# EAGLE design untitled (EAGLE 9.6.2)
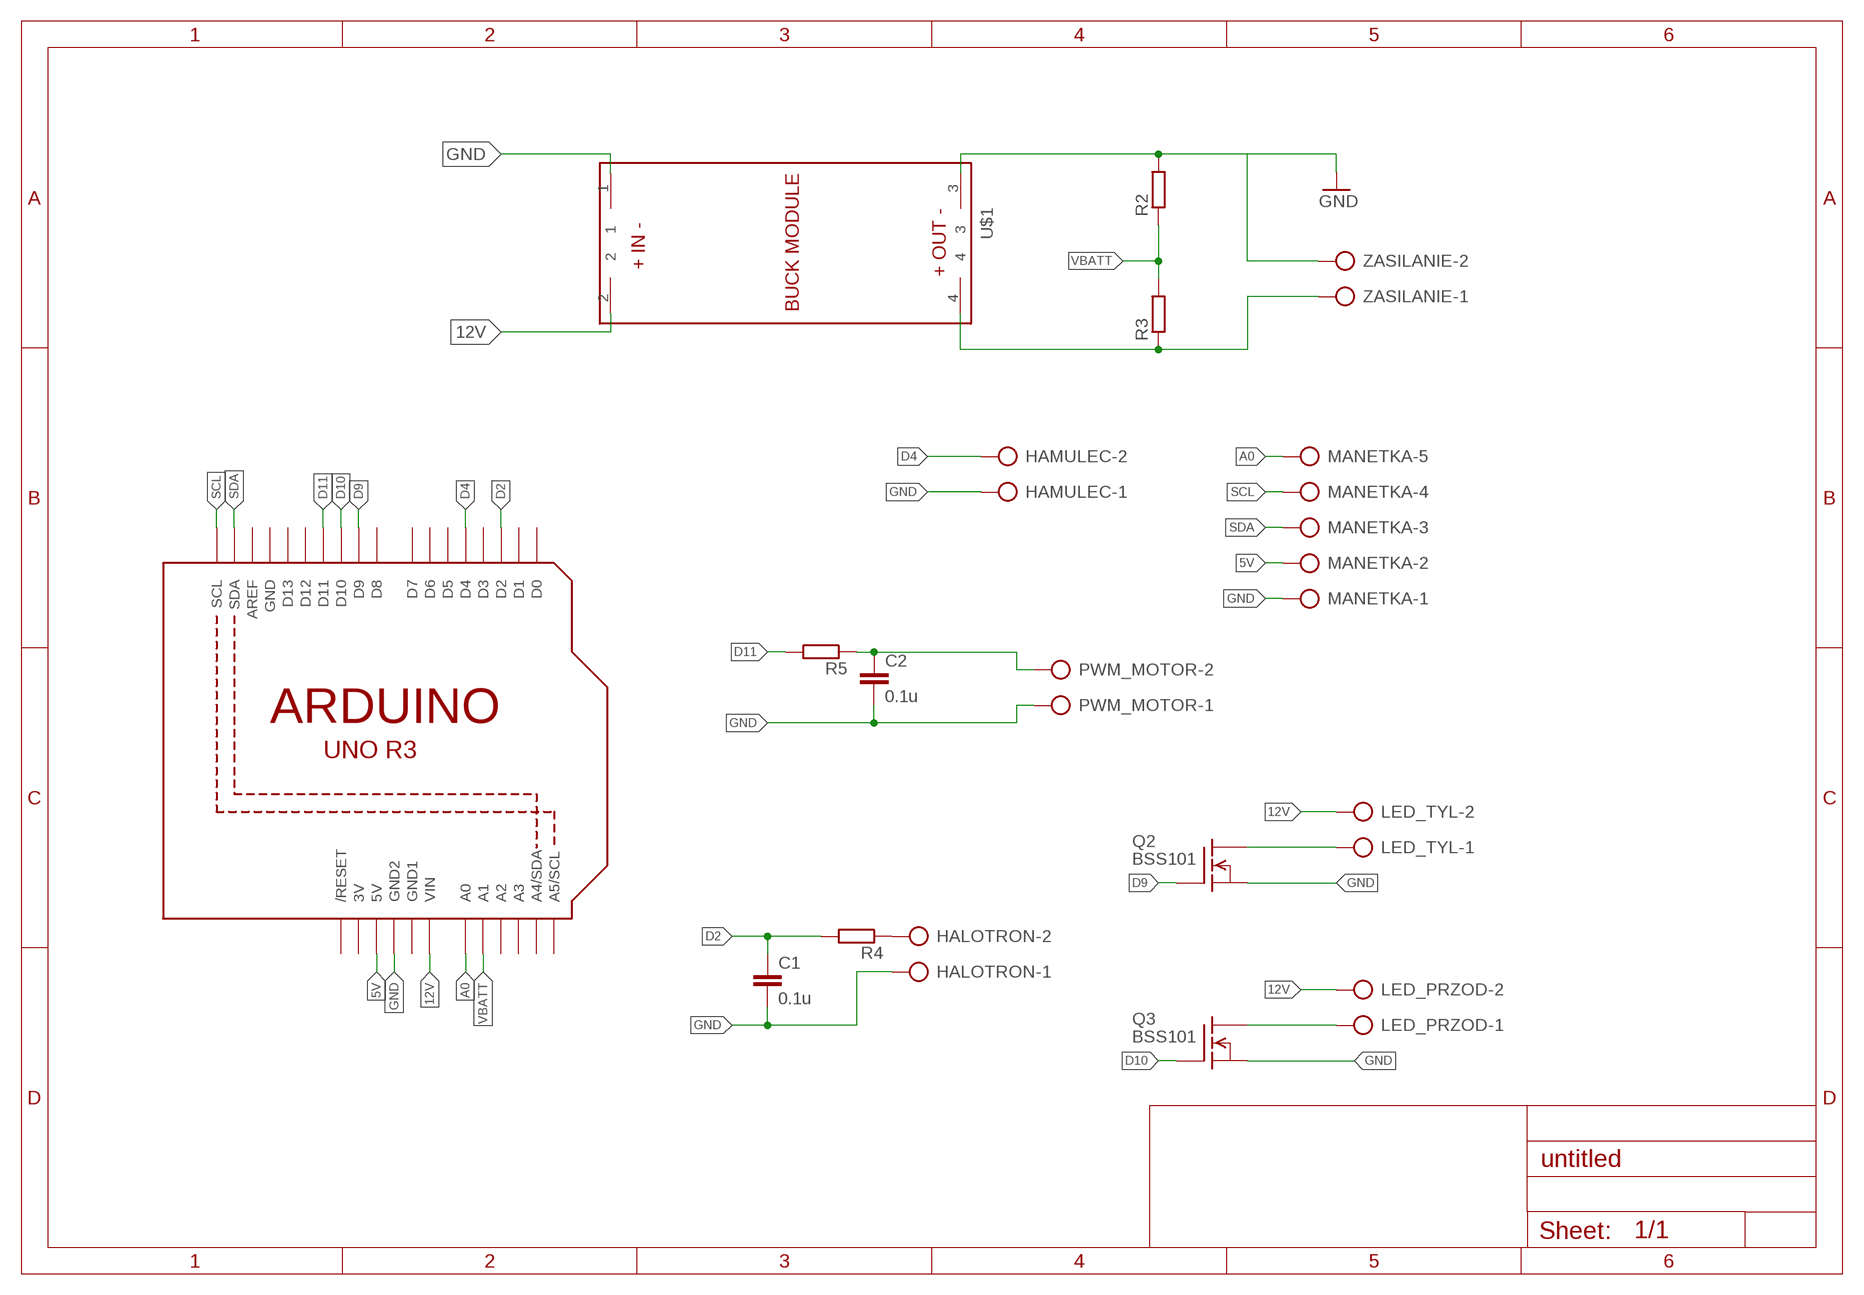
[diagram p0: schematic, sheet 1]

## Parts
C1  0.1u  C-EU025-025X050  [C025-025X050]
C2  0.1u  C-EU025-025X050  [C025-025X050]
HALOTRON  AK500/2-H  [AK500/2-H]
HAMULEC  AK500/2-H  [AK500/2-H]
LED_PRZOD  AK500/2-H  [AK500/2-H]
LED_TYL  AK500/2-H  [AK500/2-H]
MANETKA  AK300/5  [AK300/5]
PWM_MOTOR  AK500/2-H  [AK500/2-H]
Q1  ARDUINOR3-NOIOREF-NOTEXT  [ARDUINOR3-NOTEXT-NOIOREF]
Q2  BSS101  [TO92]
Q3  BSS101  [TO92]
R2  R-EU_0204/7  [0204/7]
R3  R-EU_0204/7  [0204/7]
R4  R-EU_0204/7  [0204/7]
R5  R-EU_0204/7  [0204/7]
U$1  BUCK_MODULEWITH_SMDPADS&THROUGHHOLES  [BUCK_MODULE]
ZASILANIE  AK500/2-H  [AK500/2-H]

## Nets
5V: MANETKA.2 Q1.5V
12V: LED_PRZOD.2 LED_TYL.2 Q1.VIN U$1.2
A0: MANETKA.5 Q1.A0
D2: C1.1 Q1.D2 R4.2
D4: HAMULEC.2 Q1.D4
D9: Q1.D9 Q2.2(G)
D10: Q1.D10 Q3.2(G)
D11: Q1.D11 R5.2
GND: C1.2 C2.2 HALOTRON.1 HAMULEC.1 MANETKA.1 PWM_MOTOR.1 Q1.GND2 Q2.1(S) Q3.1(S) U$1.1
N$1: R2.2 U$1.3 ZASILANIE.2 ; supply symbol labelled GND
N$2: HALOTRON.2 R4.1
N$3: R3.1 U$1.4 ZASILANIE.1
N$4: C2.1 PWM_MOTOR.2 R5.1
N$5: LED_TYL.1 Q2.3(D)
N$6: LED_PRZOD.1 Q3.3(D)
SCL: MANETKA.4 Q1.SCL
SDA: MANETKA.3 Q1.SDA
VBATT: Q1.A1 R2.1 R3.2
Unconnected: Q1.A2 Q1.A3 Q1.A4(A4/SDA) Q1.A5(A5/SCL) Q1.AREF Q1.D0 Q1.D1 Q1.D3 Q1.D5 Q1.D6 Q1.D7 Q1.D8 Q1.D12 Q1.D13 Q1.RESET(/RESET)

## Power pins joined to a net without a drawn wire
3V: Q1.3V
GND1: Q1.GND1
N$1: Q1.GND

## Library data of the parts
C1 C2 = rcl:C-EU: CAPACITOR, European symbol; SPICEPREFIX: C
HALOTRON HAMULEC LED_PRZOD LED_TYL PWM_MOTOR ZASILANIE = con-ptr500:AK500/2-H: CONNECTOR Aug. 2004 / PTR Meßtechnik: Die Bezeichnung der Serie AK505 wurde geändert. Es handelt sich hierbei um AK500 in horizontaler Ausführung.; OC_FARNELL: unknown; OC_NEWARK: unknown
MANETKA = con-ptr500:AK300/5: CONNECTOR; OC_FARNELL: unknown; OC_NEWARK: unknown
Q1 = adafruit:ARDUINOR3-NOIOREF
Q2 Q3 = transistor-fet:BSS101: N-Channel Enhancement MOSFET 200V; 0,16A; 11Ohm
R2-R5 = rcl:R-EU_: RESISTOR, European symbol; SPICEPREFIX: R
U$1 = BUCK_MODULE:BUCK_MODULE

## Board
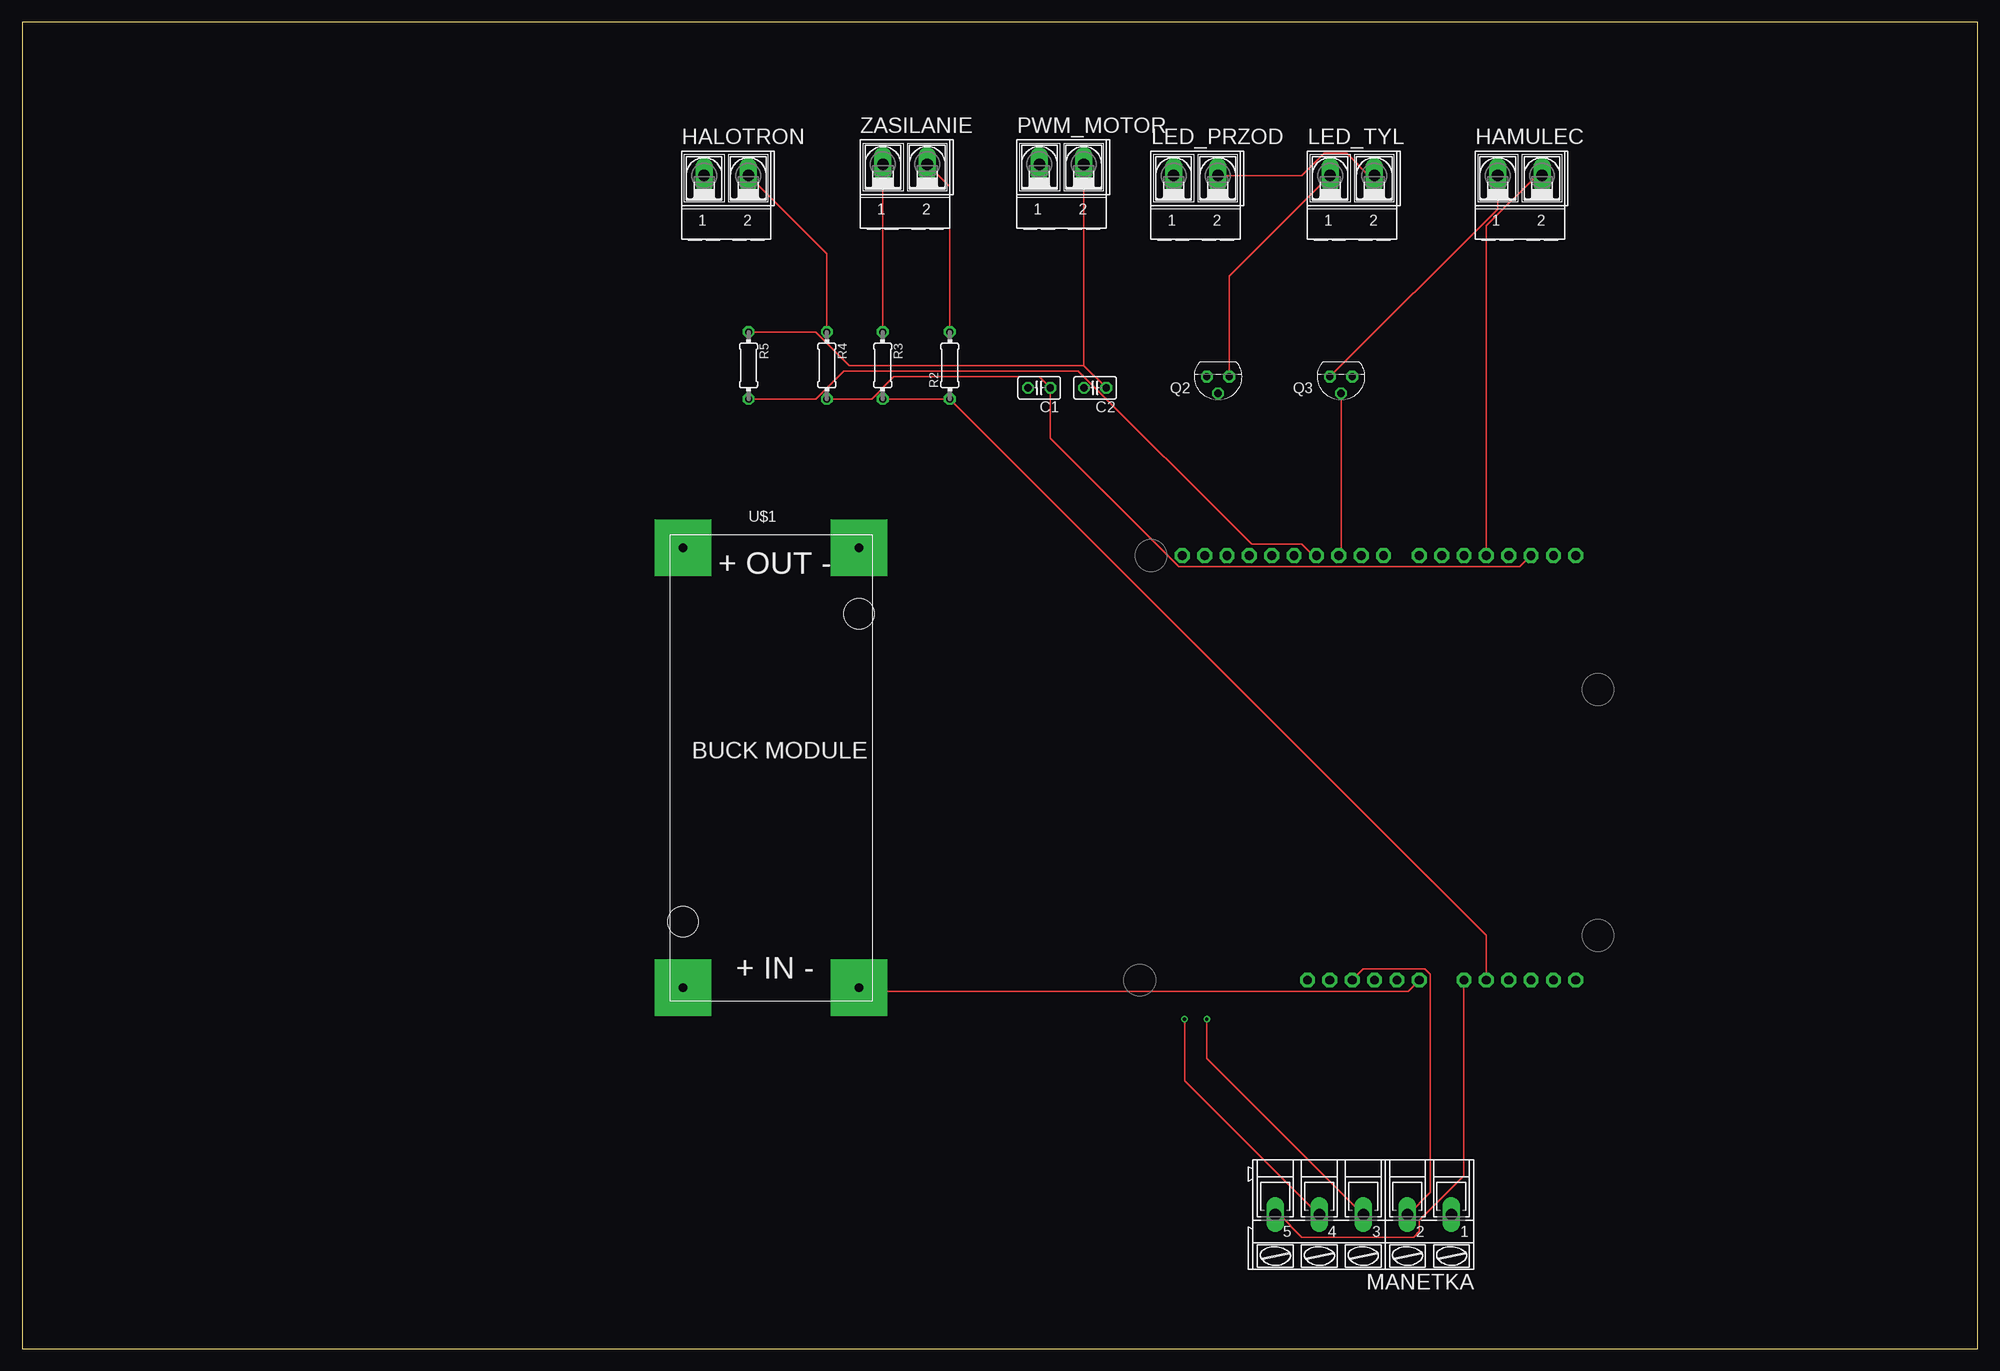
[diagram p1: board, top side]
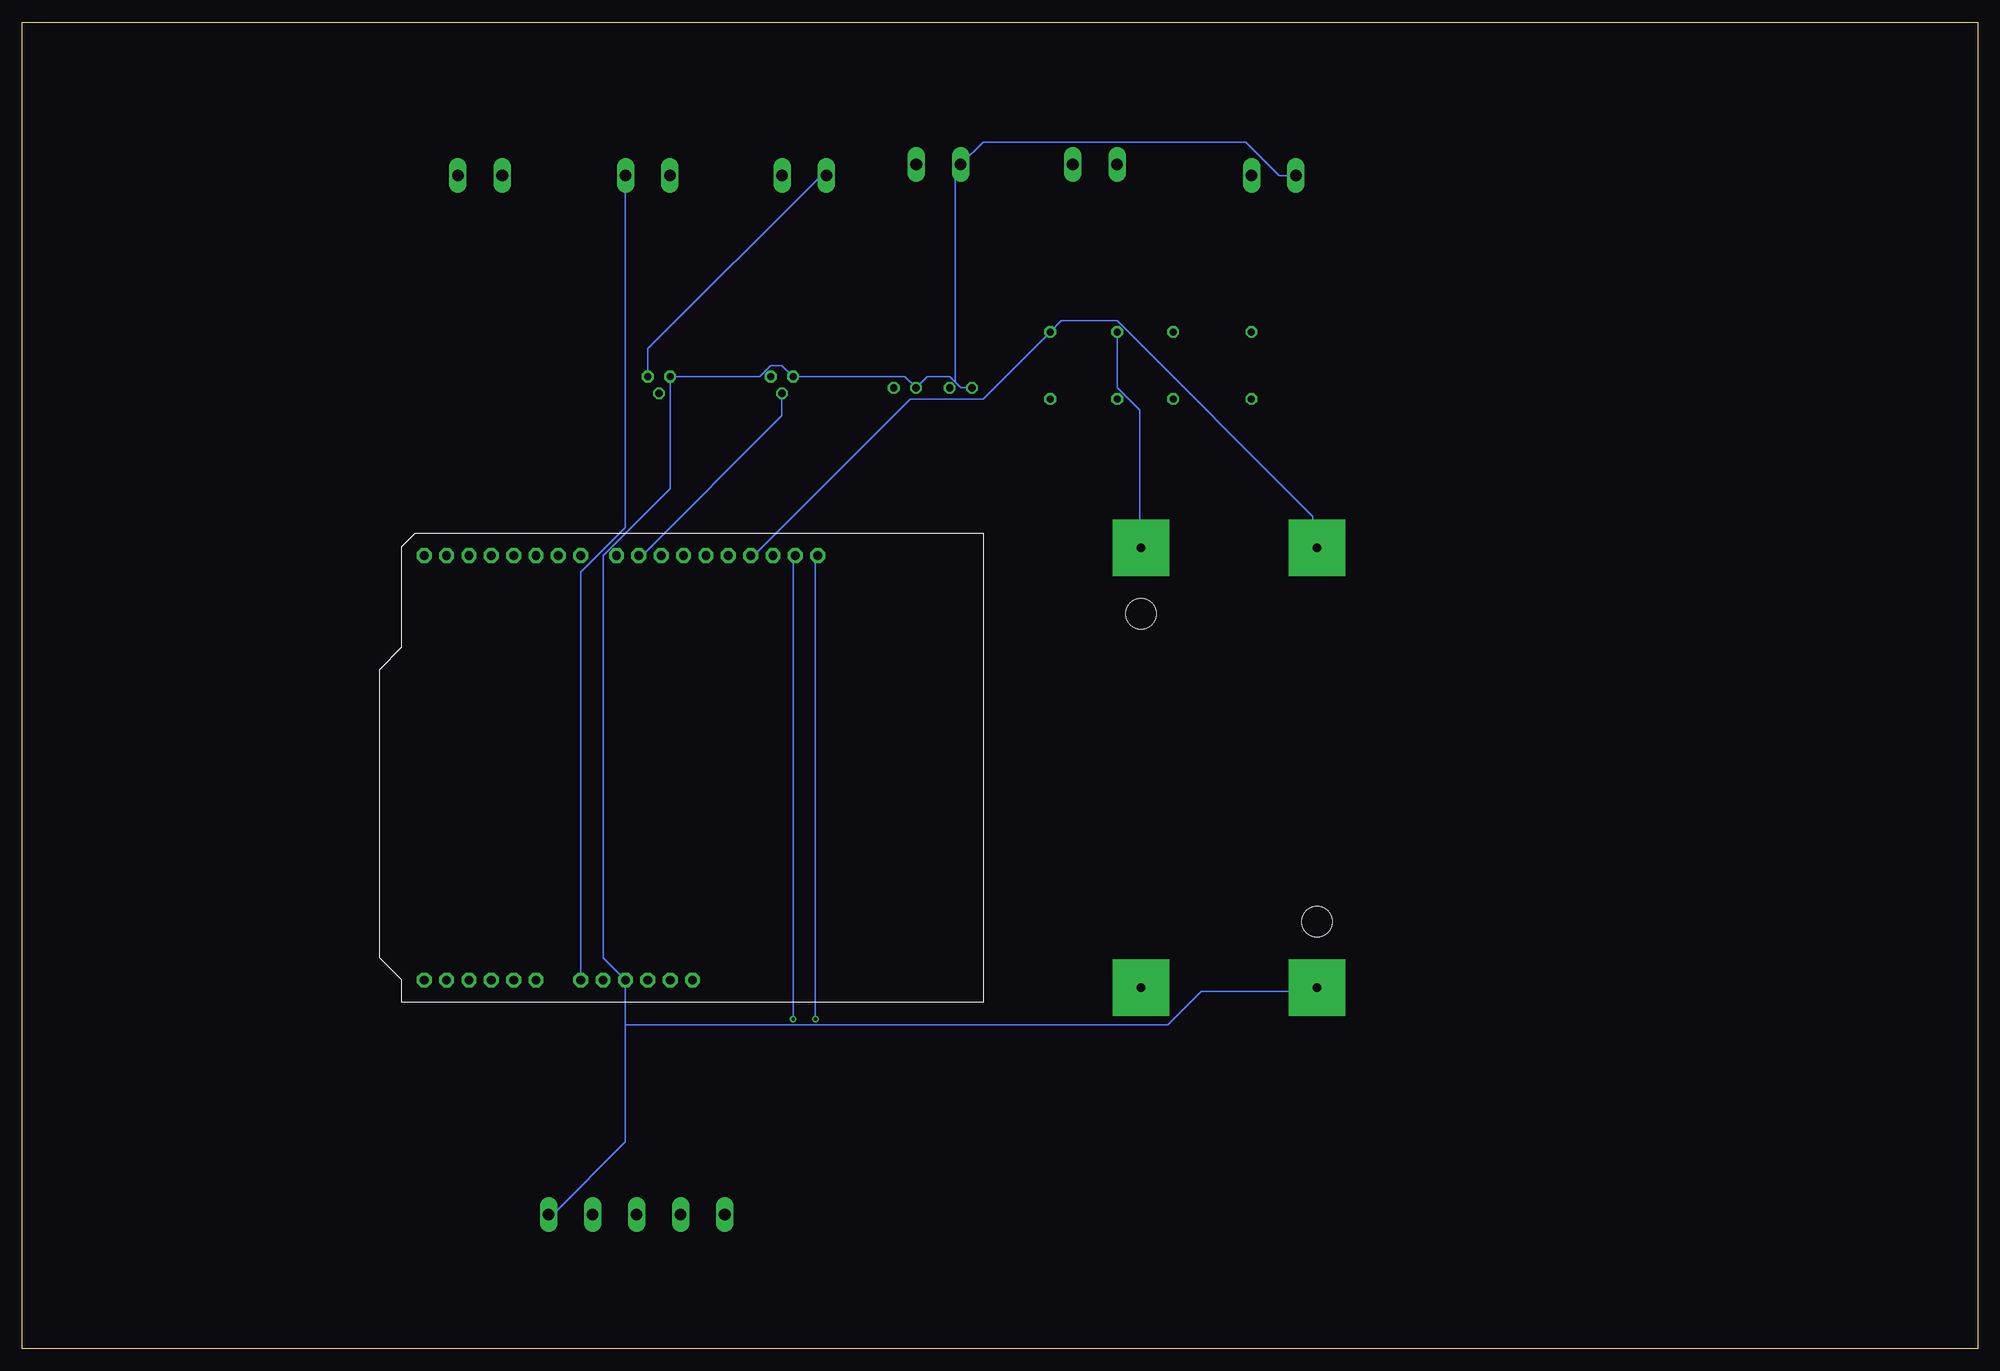
[diagram p2: board, bottom side, seen from below]

Size 222.23 x 150.8 mm. Coordinates in mm from the lower left corner, seen from the top.
Outline: 0,0 222.23,0 222.23,150.8 0,150.8 0,0
Copper layers (1*16): Top 0.035mm / dielectric 1.5mm / Bottom 0.035mm
Design rules "default": minimum track width 6mil, minimum drill 0.35mm, track to track 6mil, track to pad 6mil, pad to pad 6mil, via to via 6mil, smd to smd 6mil, copper to edge 40mil, drill to drill 6mil, minimum pad ring 10mil, minimum via ring 8mil, stop-mask expansion 4mil, vias tented up to drill 0mil, thermal gap 10mil

### Footprints (pad centres in the part's own frame; a part is rotated, then mirrored left to right if it is on the bottom)
C025-025X050 = drill 0.813 octagon: 1 -1.27,0; 2 1.27,0
AK500/2-H = drill 1.321 long: 1 -2.515,0; 2 2.515,0
AK300/5 = drill 1.321 long: 1 -10.008,0; 2 -5.004,0; 3 0,0; 4 5.004,0; 5 10.008,0
ARDUINOR3-NOTEXT-NOIOREF = drill 1 pad 1.676 octagon: 3V 35.56,2.54; 5V 38.1,2.54; A0 50.8,2.54; A1 53.34,2.54; A2 55.88,2.54; A3 58.42,2.54; A4 60.96,2.54; A5 63.5,2.54; AREF 23.876,50.8; D0 63.5,50.8; D1 60.96,50.8; D2 58.42,50.8; D3 55.88,50.8; D4 53.34,50.8; D5 50.8,50.8; D6 48.26,50.8; D7 45.72,50.8; D8 41.656,50.8; D9 39.116,50.8; D10 36.576,50.8; D11 34.036,50.8; D12 31.496,50.8; D13 28.956,50.8; GND 26.416,50.8; GND1 43.18,2.54; GND2 40.64,2.54; RESET 33.02,2.54; SCL 18.796,50.8; SDA 21.336,50.8; VIN 45.72,2.54
TO92 = drill 0.813 octagon: 1 1.27,0; 2 0,1.905; 3 -1.27,0
0204/7 = drill 0.813 octagon: 1 -3.81,0; 2 3.81,0
BUCK_MODULE = drill 1 pad 6.452 square: 1 -10,-25; 2 10,-25; 3 -10,25; 4 10,25 | hole 3.5: -10,-17.5; 10,17.5

### Placement (x,y rotation side)
C1  115.57,109.22 180 top
C2  121.92,109.22 180 top
HALOTRON  80.01,133.35 0 top
HAMULEC  170.18,133.35 0 top
LED_PRZOD  133.35,133.35 0 top
LED_TYL  151.13,133.35 0 top
MANETKA  152.4,15.24 180 top
PWM_MOTOR  118.11,134.62 0 top
Q1  113.03,39.37 0 top
Q2  135.89,110.49 180 top
Q3  149.86,110.49 180 top
R2  105.41,111.76 90 top
R3  97.79,111.76 270 top
R4  91.44,111.76 270 top
R5  82.55,111.76 270 top
U$1  85.09,66.04 0 top
ZASILANIE  100.33,134.62 0 top

### Tracks (layer width: path | path; a pad name or v marks a point on that pad's centre or on a via)
5V
  Top 0.152: Q1.5V 152.4,43.18 159.38,43.18 160.02,42.55 160.02,17.78 157.48,15.24 MANETKA.2
12V
  Top 0.152: LED_PRZOD.2 145.41,133.35 147.96,135.89 150.5,135.89 153.03,133.35 LED_TYL.2 | Q1.VIN 157.48,40.64 95.25,40.64 U$1.2
  Bottom 0.152: Q1.VIN 158.75,88.27 153.67,93.34 153.67,133.35 LED_TYL.2
A0
  Top 0.152: Q1.A0 163.83,19.68 158.75,14.61 158.75,13.34 158.12,12.7 145.41,12.7 142.88,15.24 MANETKA.5
D2
  Top 0.152: R4.2 96.52,107.95 99.06,110.49 115.57,110.49 C1.1 116.84,103.5 131.44,88.9 170.18,88.9 Q1.D2
D4
  Top 0.152: Q1.D4 166.37,127.64 172.09,133.35 HAMULEC.2
D9
  Bottom 0.152: Q2.2 135.89,106.05 151.76,90.17 Q1.D9
D10
  Top 0.152: Q3.2 149.86,90.17 Q1.D10
D11
  Top 0.152: R5.2 90.17,107.95 93.34,111.12 120.02,111.12 139.7,91.44 145.41,91.44 146.69,90.17 Q1.D11
GND
  Top 0.152: Q3.1 167.64,129.54 167.64,133.35 HAMULEC.1
  Bottom 0.152: HALOTRON.1 79.38,133.35 83.19,137.16 113.03,137.16 115.57,134.62 PWM_MOTOR.1 116.2,134.62 116.2,109.86 | C1.2 115.57,109.22 116.2,109.86 | 116.2,109.86 116.84,110.49 119.38,110.49 C2.2 121.92,110.49 Q2.1 135.89,111.76 137.16,111.76 138.43,110.49 Q3.1 148.59,97.79 156.21,90.17 156.21,44.45 Q1.GND2 153.67,36.83 | 153.67,36.83 153.67,23.5 161.93,15.24 MANETKA.1 | 153.67,36.83 92.08,36.83 88.27,40.64 75.56,40.64 U$1.1
N$1
  Top 0.152: R2.2 105.41,132.08 102.87,134.62 ZASILANIE.2
  Bottom 0.152: Q1.GND 139.06,90.17 121.28,107.95 113.03,107.95 R2.2 104.14,116.84 97.79,116.84 75.56,94.61 75.56,91.44 U$1.3
N$2
  Top 0.152: R4.1 91.44,124.46 82.55,133.35 HALOTRON.2
N$3
  Top 0.152: R3.1 97.79,134.62 ZASILANIE.1
  Bottom 0.152: R3.1 97.79,109.22 95.25,106.68 95.25,91.44 U$1.4
N$4
  Top 0.152: R5.1 90.17,115.57 93.98,111.76 120.65,111.76 | C2.1 120.65,111.76 | 120.65,111.76 120.65,134.62 PWM_MOTOR.2
N$5
  Top 0.152: Q2.3 137.16,121.92 148.59,133.35 LED_TYL.1
N$6
  Bottom 0.152: Q3.3 151.13,113.67 131.44,133.35 LED_PRZOD.1
SCL  (via drill 0.35)
  Top 0.152: v132.08,37.47 132.08,30.48 147.32,15.24 MANETKA.4
  Bottom 0.152: v132.08,37.47 132.08,90.17 Q1.SCL
SDA  (via drill 0.35)
  Top 0.152: v134.62,37.47 134.62,33.02 MANETKA.3
  Bottom 0.152: v134.62,37.47 134.62,90.17 Q1.SDA
VBATT
  Top 0.152: R3.2 R2.1 166.37,46.99 Q1.A1